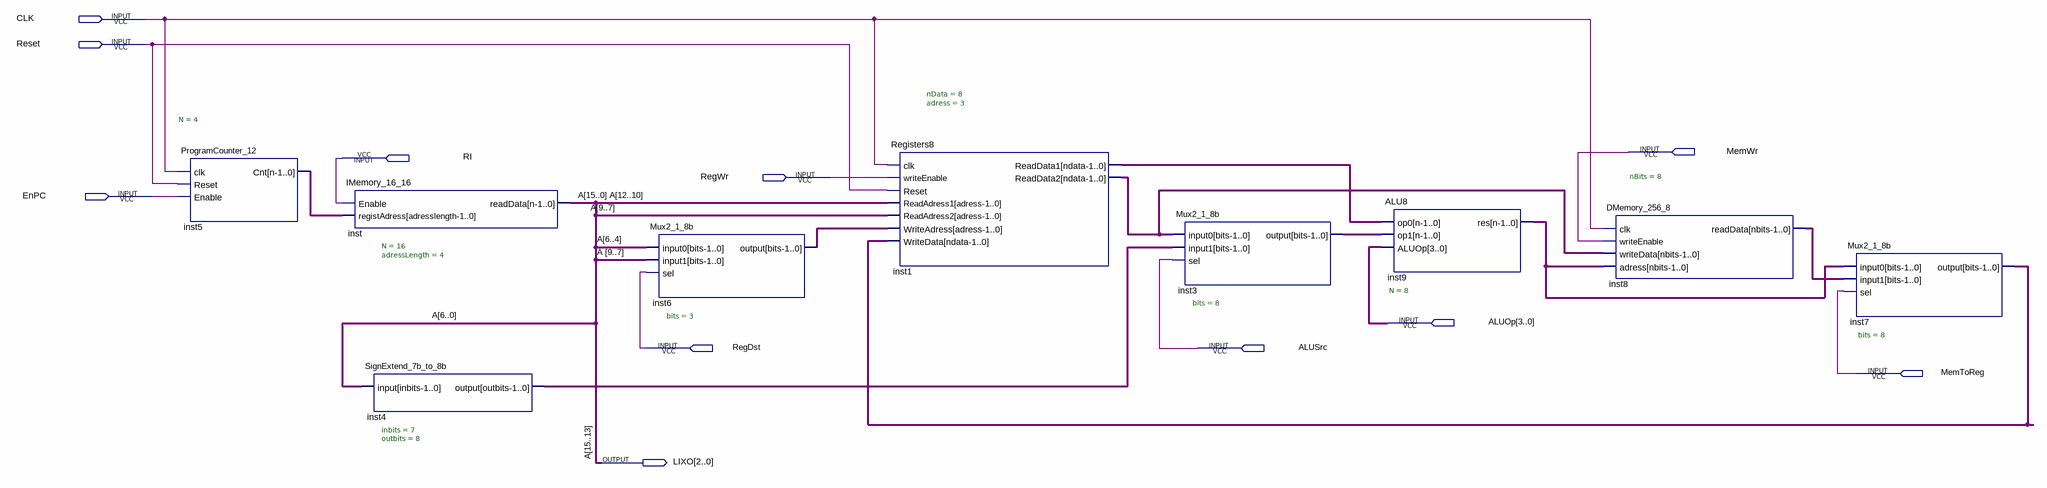
[diagram p0: schematic sheet]
// Quartus schematic Project_Fase1_Visual.bdf as structural Verilog: 9 symbols, 11 pins
module Project_Fase1_Visual (
  input  CLK,
  input  Reset,
  input  MemWr,
  input  RI,
  input  RegWr,
  input  EnPC,
  input  [3:0] ALUOp,
  input  RegDst,
  input  ALUSrc,
  input  MemToReg,
  output [2:0] LIXO
);

  wire [2:0] inst6_output;
  wire [3:0] inst5_cnt;
  wire [7:0] inst1_readdata1, inst1_readdata2, inst3_output, inst4_output, inst7_output, inst8_readdata,
       inst9_res;
  wire [12:0] A;

  ProgramCounter_12 #(.N(4)) inst5 (.clk(CLK), .Reset(Reset), .Enable(EnPC), .Cnt(inst5_cnt));
  IMemory_16_16 #(.N(16), .adressLength(4)) inst (.Enable(RI), .registAdress(inst5_cnt), .readData({LIXO, A}));
  SignExtend_7b_to_8b #(.inbits(7), .outbits(8)) inst4 (.\input (A[6:0]), .\output (inst4_output));
  Mux2_1_8b #(.bits(3)) inst6 (.input0(A[6:4]), .input1(A[9:7]), .sel(RegDst), .\output (inst6_output));
  Registers8 #(.nData(8), .adress(3)) inst1 (
    .clk(CLK), .writeEnable(RegWr), .Reset(Reset), .ReadAdress1(A[12:10]), .ReadAdress2(A[9:7]),
    .WriteAdress(inst6_output), .WriteData(inst7_output), .ReadData1(inst1_readdata1),
    .ReadData2(inst1_readdata2));
  Mux2_1_8b #(.bits(8)) inst3 (.input0(inst1_readdata2), .input1(inst4_output), .sel(ALUSrc), .\output (inst3_output));
  ALU8 #(.N(8)) inst9 (.op0(inst1_readdata1), .op1(inst3_output), .ALUOp(ALUOp), .res(inst9_res));
  DMemory_256_8 #(.nBits(8)) inst8 (
    .clk(CLK), .writeEnable(MemWr), .writeData(inst1_readdata2), .adress(inst9_res), .readData(inst8_readdata));
  Mux2_1_8b #(.bits(8)) inst7 (.input0(inst9_res), .input1(inst8_readdata), .sel(MemToReg), .\output (inst7_output));

  // Other names for the same wires on the sheet: A[15:13] = LIXO
endmodule
